# EAGLE design DCSwitch (EAGLE 5.11)
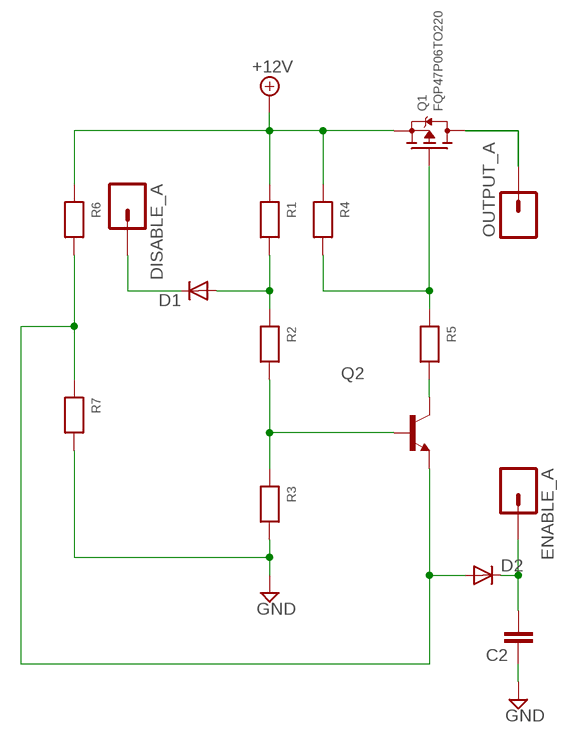
[diagram p0: schematic, sheet 1]

## Parts
C2  CAP1206  [1206]
D1  DIODEHV  [DIODE-HV]
D2  DIODEHV  [DIODE-HV]
DISABLE_A  M01PTH_LONGPAD  [1X01_LONGPAD]
ENABLE_A  M01PTH_LONGPAD  [1X01_LONGPAD]
OUTPUT_A  M01PTH_LONGPAD  [1X01_LONGPAD]
Q1  FQP47P06TO220  [TO220]
Q2  MMBT2222ALT1-NPN-SOT23-BEC  [SOT23-BEC]
R1  RESISTOR1206  [1206]
R2  RESISTOR1206  [1206]
R3  RESISTOR1206  [1206]
R4  RESISTOR1206  [1206]
R5  RESISTOR1206  [1206]
R6  RESISTOR1206  [1206]
R7  RESISTOR1206  [1206]

## Nets
+12V [power]: Q1.3(S) R1.1 R4.1 R6.1
GND: C2.1 R3.2 R7.2
N$1: D1.A R1.2 R2.1
N$2: Q2.B R2.2 R3.1
N$3: D2.A Q2.E R6.2 R7.1
N$4: C2.2 D2.C ENABLE_A.1
N$5: Q2.C R5.2
N$6: Q1.1(G) R4.2 R5.1
N$7: OUTPUT_A.1 Q1.2(D)
N$8: D1.C DISABLE_A.1

## Library data of the parts
C2 = SparkFun:CAP: Capacitor Standard 0603 ceramic capacitor, and 0.1" leaded capacitor.
D1 D2 = SparkFun:DIODE: Diode These are standard reverse protection diodes and small signal diodes. SMA package can handle up to about 1A. SOD-323 can handle about 200mA. What the SOD-323 package when ordering, there are some mfgs out there that are 5-pin packages.
DISABLE_A ENABLE_A OUTPUT_A = SparkFun:M01: Header 1 Standard 1-pin 0.1" header. Use with straight break away headers (SKU : PRT-00116), right angle break away headers (PRT-00553), swiss pins (PRT-00743), machine pins (PRT-00117), and female headers (PRT-00115).
Q1 = charliex-nsl:FQP47P06: 60V P-Channel MOSFET -47A, -60V, RDS(on) = 0.026? @VGS = -10 V ? Low gate charge ( typical 84 nC) ? Low Crss ( typical 320 pF) ? Fast switching ? 100% avalanche tested ? Improved dv/dt capability ? 175°C maximum junction temperature rating
Q2 = transistor:*-NPN-: NPN Transistror BF959 corrected 2008.03.06
R1-R7 = microbuilder:RESISTOR: Resistors 0402 - 0402 Surface Mount Package 10.0K 1% 1/16W [Digikey: 311-10.0KLRTR-ND] 0603 - 0603 Surface Mount Package 0 Ohm 1/10 Watt 1% Resistor 15 Ohm 1/10 Watt 1% Resistor 33 Ohm 1/10 Watt 1% Resistor 49.9 Ohm 1/10 Watt 1% Resistor 100 Ohm 1/10 Watt 1% Resistor 150 Ohm 1/10 Watt 1% Resistor 240 Ohm 1/10 Watt 1% Resistor 390 Ohm 1/10 Watt 1% Resistor 560 Ohm 1/10 Watt 1% Resistor 750 Ohm 1/10 Watt 1% Resistor 1.0K Ohm 1/10 Watt 1% Resistor 1.5K Ohm 1/10 Watt 1% Resistor 2.0K Ohm 1/10 Watt 1% Resistor 4.7K Ohm 1/10 Watt 1% Resistor 10.0K Ohm 1/10 Watt 1% Resistor 20.0K Ohm 1/10 Watt 1% Resistor 33.0K Ohm 1/10 Watt 1% Resistor 100.0K Ohm 1/10 Watt 1% Resistor 0805 - 0805 Surface Mount Package 0 Ohm 1/8 Watt 1% Resistor 33 Ohm 1/8 Watt 1% Resistor 100 Ohm 1/8 Watt 1% Resistor 150 Ohm 1/8 Watt 1% Resistor 200 Ohm 1/8 Watt 1% Resistor 240 Ohm 1/8 Watt 1% Resistor 330 Ohm 1/8 Watt 1% Resistor 390 Ohm 1/8 Watt 1% Resistor 470 Ohm 1/8 Watt 1% Resistor 1.0K Ohm 1/8 Watt 1% Resistor 1.5K Ohm 1/8 Watt 1% Resistor 2.0K Ohm 1/8 Watt 1% Resistor 4.7K Ohm 1/8 Watt 1% Resistor 5.1K Ohm 1/8 Watt 1% Resistor 5.6K Ohm 1/8 Watt 1% Resistor 10.0K Ohm 1/8 Watt 1% Resistor 22.0K Ohm 1/8 Watt 1% Resistor 33.0K Ohm 1/8 Watt 1% Resistor 100K Ohm 1/8 Watt 1% Resistor 1206 - 1206 Surface Mount Package

## Net classes
1 power: width 0.762 mm, drill 0.508 mm, clearance 0.508 mm

## Board
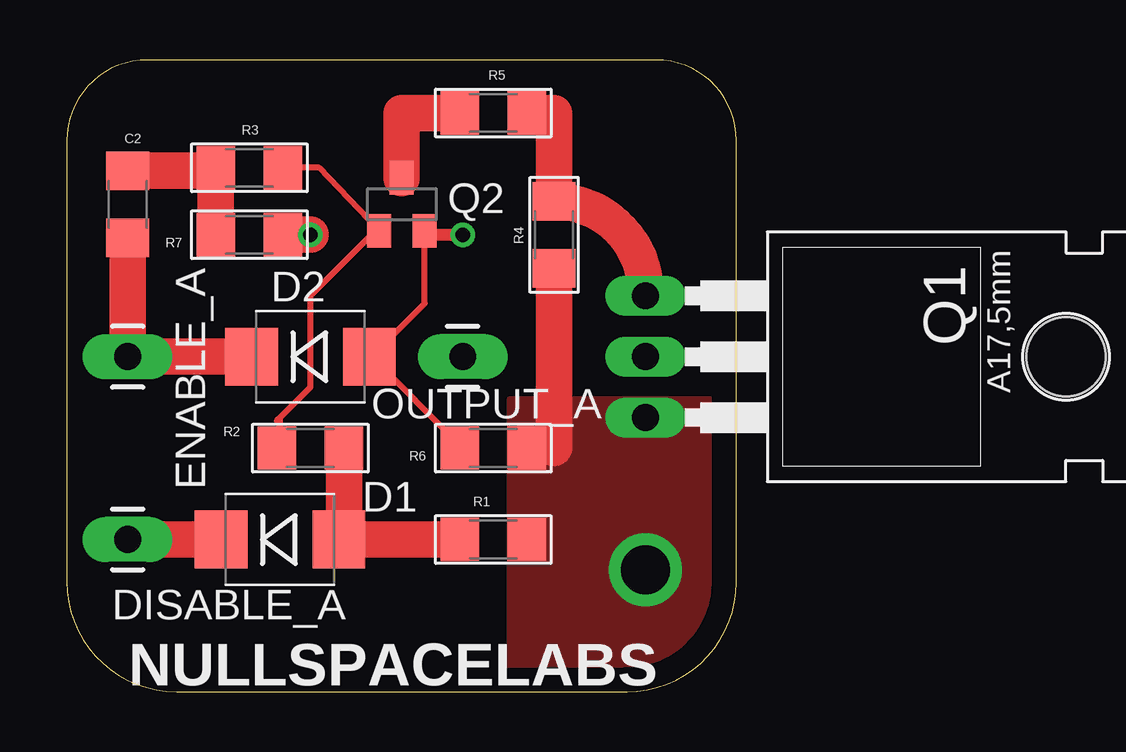
[diagram p1: board, top side]
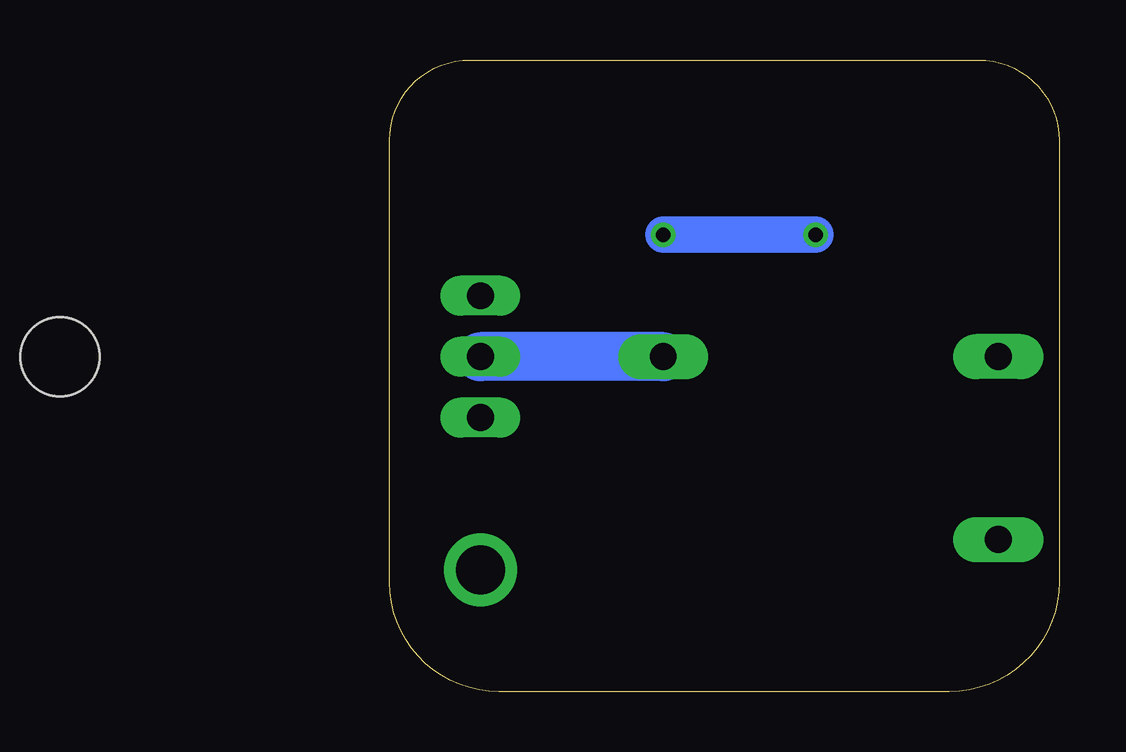
[diagram p2: board, bottom side, seen from below]

Size 27.92 x 26.34 mm. Coordinates in mm from the lower left corner, seen from the top.
Outline: 27.92,22.99 arc90 24.57,26.34 3.37,26.34 arc90 0,22.97 0,4.58 arc90 4.58,0 23.36,0 arc90 27.92,4.56 27.92,22.99
Copper layers (1*16): Top 0.035mm / dielectric 1.5mm / Bottom 0.035mm
Design rules "default": minimum track width 10mil, minimum drill 24mil, track to track 8mil, track to pad 8mil, pad to pad 8mil, via to via 8mil, smd to smd 8mil, copper to edge 40mil, drill to drill 8mil, minimum pad ring 10mil, minimum via ring 8mil, stop-mask expansion 4mil, vias tented up to drill 0mil, thermal gap 10mil

### Footprints (pad centres in the part's own frame; a part is rotated, then mirrored left to right if it is on the bottom)
1206 = smd 1.6 x 1.8: 1 -1.4,0; 2 1.4,0
DIODE-HV = smd 2.2 x 2.4: A 2.454,0; C -2.454,0
1X01_LONGPAD = drill 1.118 pad 1.88 long: 1 0,0
TO220 = drill 1.118 long: 1 -2.54,0; 2 0,0; 3 2.54,0 | hole 3.302: 0,17.526
SOT23-BEC = smd 1 x 1.4: B -0.95,-1.1; C 0,1.1; E 0.95,-1.1

### Placement (x,y rotation side)
C2  2.54,20.32 270 top
D1  8.89,6.35 0 top
D2  10.16,13.97 0 top
DISABLE_A  2.54,6.35 90 top
ENABLE_A  2.54,13.97 270 top
OUTPUT_A  16.51,13.97 90 top
Q1  24.13,13.97 270 top
Q2  13.97,20.32 0 top
R1  17.78,6.35 180 top
R2  10.16,10.16 180 top
R3  7.62,21.84 180 top
R4  20.32,19.05 90 top
R5  17.78,24.13 180 top
R6  17.78,10.16 180 top
R7  7.62,19.05 180 top

### Tracks (layer width: path | path; a pad name or v marks a point on that pad's centre or on a via)
+12V  (via drill 2.03)
  Top 1.524: 20.32,10.16 R4.1
  other vias: 24.13,5.08
  pour Top (no thermals): 18.47,12.19 18.47,0 23.41,0 arc89 27.99,4.53 28.07,12.19
GND
  Top 0.254: R3.2 6.09,21.72
  Top 1.524: 6.09,21.72 C2.1 | R7.2 R3.2
N$1
  Top 0.254: D1.A 11.43,6.35 11.56,6.48
  Top 1.524: 11.43,6.35 R1.2 | 11.56,6.48 R2.1
N$2
  Top 0.254: 8.89,11.43 8.76,11.3 | 8.89,11.43 10.16,12.7 10.16,16.51 12.7,19.05 Q2.B 10.52,21.84 R3.1 | 8.89,11.43 8.89,10.16 R2.2
N$3  (via drill 0.61)
  Top 0.254: 12.7,13.97 14.92,16.19 Q2.E 15.24,19.05 | R6.2 16.38,10.29 12.7,13.97 | 12.7,13.97 D2.A
  Top 0.508: 15.24,19.05 v16.51,19.05
  Top 1.524: v10.16,19.05 R7.1
  Bottom 1.524: v16.51,19.05 v10.16,19.05
N$4
  Top 1.524: C2.2 ENABLE_A.1 D2.C
N$5
  Top 1.524: R5.2 13.97,24.13 Q2.C
N$6
  Top 0.254: 24.13,16.64 Q1.1
  Top 1.524: 24.13,16.64 arc90 R4.2 20.32,24.13 R5.1
N$7
  Bottom 2.032: OUTPUT_A.1 Q1.2
N$8
  Top 1.524: DISABLE_A.1 D1.C

### Text on the board
tNames: NULLSPACELABS